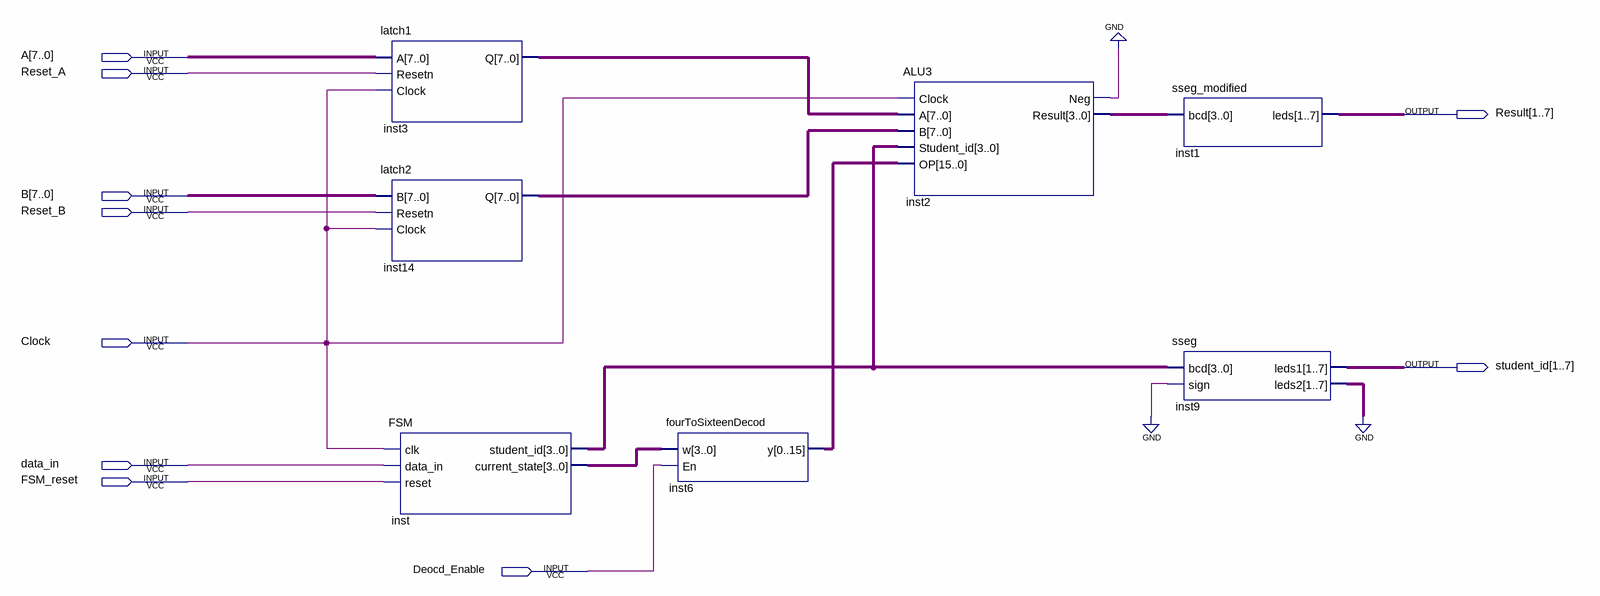
[diagram p0: schematic sheet]
// Quartus schematic Problem3.bdf as structural Verilog: 7 symbols, 10 pins
module Problem3 (
  input  [7:0] A,
  input  Reset_A,
  input  [7:0] B,
  input  Reset_B,
  input  Clock,
  input  data_in,
  input  FSM_reset,
  input  Deocd_Enable,
  output [1:7] Result,
  output [1:7] student_id
);

  wire inst2_neg;
  wire [3:0] inst2_result, inst_current_state, inst_student_id;
  wire [6:0] inst9_leds2;
  wire [7:0] inst3_q, inst14_q;
  wire [15:0] inst6_y;

  latch1 inst3 (.A(A), .Resetn(Reset_A), .Clock(Clock), .Q(inst3_q));
  latch2 inst14 (.B(B), .Resetn(Reset_B), .Clock(Clock), .Q(inst14_q));
  FSM inst (
    .clk(Clock), .data_in(data_in), .reset(FSM_reset), .student_id(inst_student_id),
    .current_state(inst_current_state));
  fourToSixteenDecod inst6 (.w(inst_current_state), .En(Deocd_Enable), .y(inst6_y));
  ALU3 inst2 (
    .Clock(Clock), .A(inst3_q), .B(inst14_q), .Student_id(inst_student_id), .OP(inst6_y), .Neg(inst2_neg),
    .Result(inst2_result));
  sseg_modified inst1 (.bcd(inst2_result), .leds(Result));
  sseg inst9 (.bcd(inst_student_id), .sign(1'b0), .leds1(student_id), .leds2(inst9_leds2));
  // also tied to GND on the sheet: {inst9_leds2[0], inst9_leds2[1], inst9_leds2[2], inst9_leds2[3], inst9_leds2[4], inst9_leds2[5], inst9_leds2[6], inst2_neg}
endmodule
